# EAGLE design usb-to-5v (EAGLE 6.4)
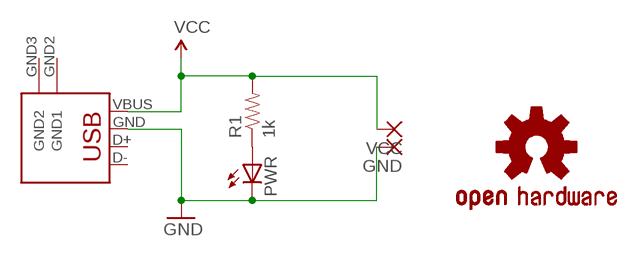
[diagram p0: schematic, sheet 1]

## Parts
GND  1,6/0,9  [1,6/0,9]
JP1  USB-A-H  [USB-A-H]
LOGO1  OSHW-LOGOS  [OSHW-LOGO-S]
PWR  LED0805  [0805-LED]
R1  1k  RESISTOR0805  [0805-RC]
VCC  1,6/0,9  [1,6/0,9]

## Nets
GND: GND.1(P) JP1.GND(VBUS) PWR.C
N$1: PWR.A R1.1
VCC: JP1.VBUS(GND) R1.2 VCC.1(P)
Unconnected: JP1.D+(D-) JP1.D-(D+) JP1.GND2(GND1) JP1.GND3(GND2)

## Library data of the parts
GND VCC = wirepad:1,6/0,9: THROUGH-HOLE PAD
JP1 = Hoektronics:USB: USB Connectors USB-B-PTH is fully proven SKU : PRT-00139 USB-miniB is fully proven SKU : PRT-00587 USB-A-PCB is untested. USB-A-H is throughly reviewed, but untested. Spark Fun Electronics SKU : PRT-00437 USB-B-SMT is throughly reviewed, but untested. Needs silkscreen touching up. USB-A-S has not been used/tested USB-MB-H has not been used/tested
LOGO1 = SparkFun-Aesthetics:OSHW-LOGO: Open Source Hardware Logo This logo indicates the piece of hardware it is found on incorporates a OSHW license and/or adheres to the definition of open source hardware found here: http://freedomdefined.org/OSHW
PWR = Hoektronics:LED: LEDs Standard schematic elements and footprints for 5mm, 3mm, 1206, and 0603 sized LEDs. 5mm - Spark Fun Electronics SKU : COM-00529 (and others)
R1 = Hoektronics:RESISTOR: Resistor Basic schematic elements and footprints for 0603, 1206, and PTH 1/10th watt (small) resistors.

## Board
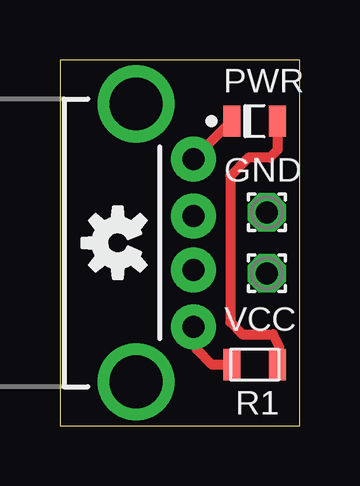
[diagram p1: board, top side]
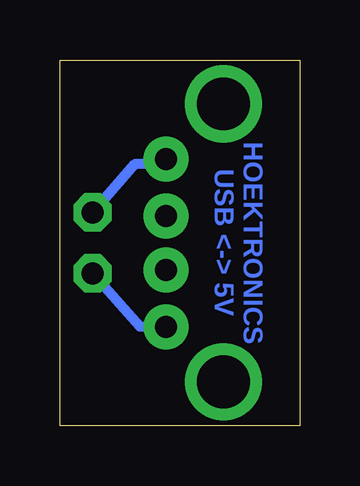
[diagram p2: board, bottom side, seen from below]

Size 10 x 15.25 mm. Coordinates in mm from the lower left corner, seen from the top.
Outline: 0,0 10,0 10,15.25 0,15.25 0,0
Copper layers (1*16): Top 0.035mm / dielectric 1.5mm / Bottom 0.035mm
Design rules "default": minimum track width 10mil, minimum drill 24mil, track to track 8mil, track to pad 8mil, pad to pad 8mil, via to via 8mil, smd to smd 8mil, copper to edge 40mil, drill to drill 8mil, minimum pad ring 10mil, minimum via ring 8mil, stop-mask expansion 4mil, vias tented up to drill 0mil, thermal gap 10mil

### Footprints (pad centres in the part's own frame; a part is rotated, then mirrored left to right if it is on the bottom)
1,6/0,9 = drill 0.914 pad 1.6 octagon: 1 0,0
USB-A-H = drill 0.914 pad 1.88: D+ 2.4,1.127; D- 2.4,-1.127; GND 2.4,3.5; VBUS 2.4,-3.5 | drill 2.2: GND2 0,-5.8; GND3 0,5.8
0805-LED = smd 0.7 x 1.3: A 0.95,0; C -0.95,0
0805-RC = smd 0.7 x 1.3: 1 -0.95,0; 2 0.95,0

### Placement (x,y rotation side)
GND  8.64,8.89 0 top
JP1  3.17,7.62 0 top
LOGO1  2.41,7.62 90 top
PWR  8.13,12.7 0 top
R1  8.13,2.54 180 top
VCC  8.64,6.35 0 top

### Tracks (layer width: path | path; a pad name or v marks a point on that pad's centre or on a via)
GND
  Top 0.406: PWR.C 7.16,12.7 JP1.GND
  Bottom 0.406: GND.1 6.86,10.92 5.77,10.92 JP1.GND
N$1
  Top 0.406: PWR.A 9.08,11.49 8.76,11.18 7.87,11.18 7.11,10.41 7.11,4.32 7.62,3.81 8.89,3.81 9.14,3.3 9.14,2.73 R1.1
VCC
  Top 0.406: R1.2 6.35,2.54 5.71,3.17 5.71,3.98 JP1.VBUS
  Bottom 0.406: JP1.VBUS 6.66,4.12 VCC.1

### Text on the board
Bottom: HOEKTRONICS / USB <-> 5V